# Altium project Steering_Wheel_ECU.PrjPcb
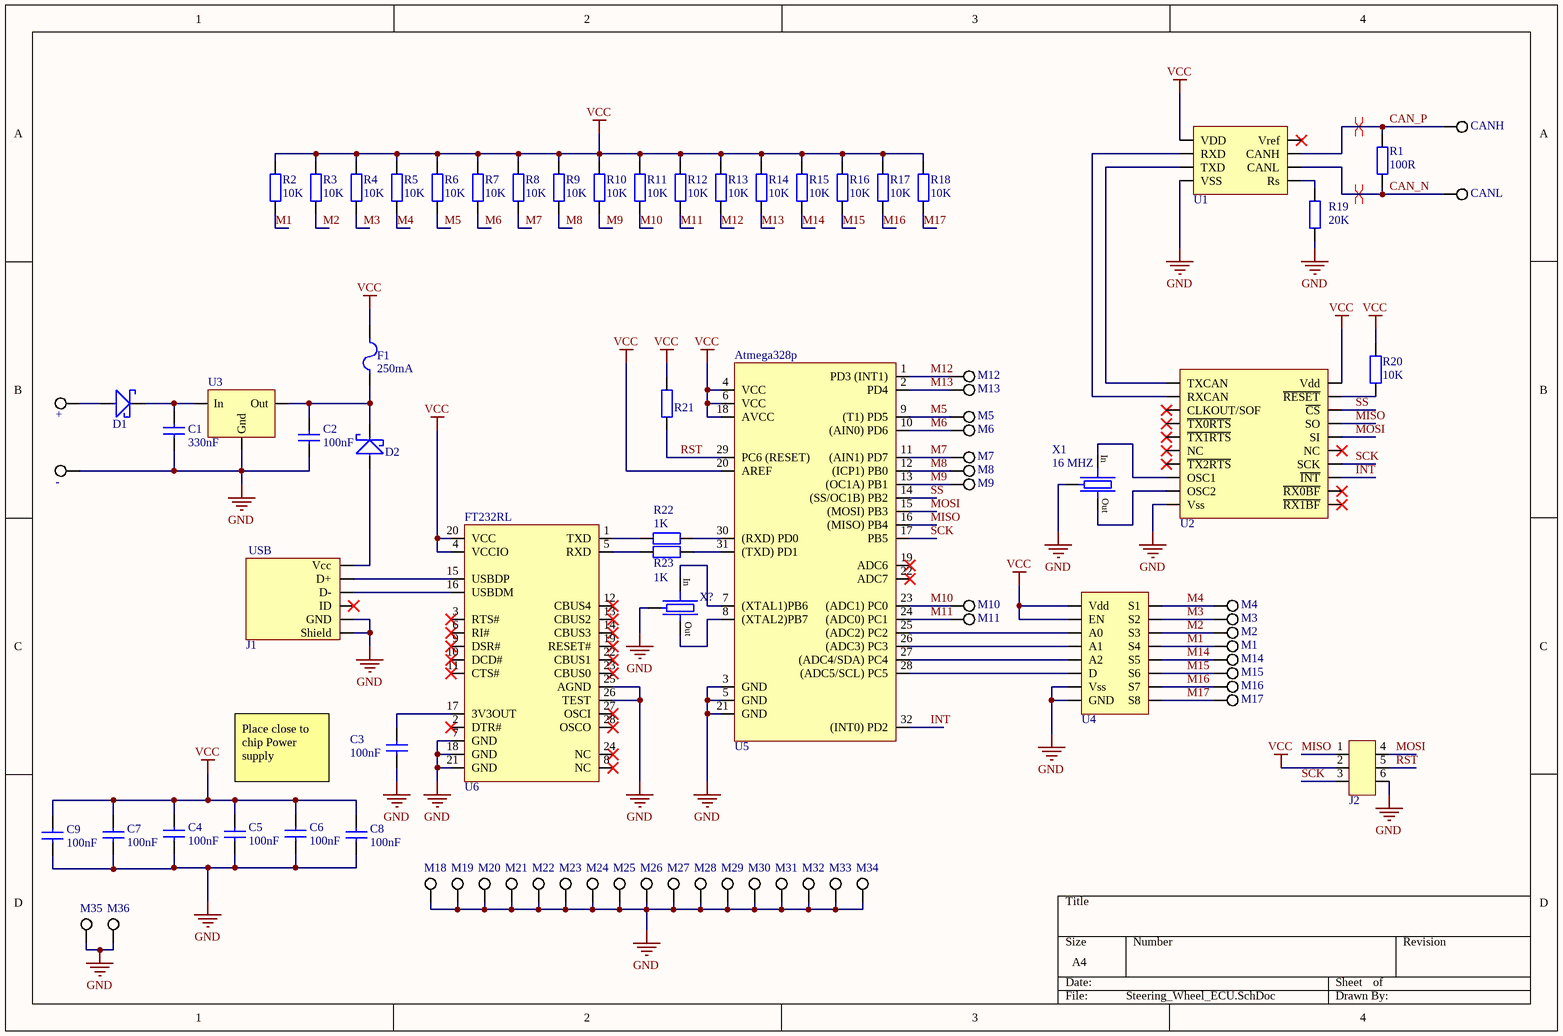
[diagram p0: Steering_Wheel_ECU.SchDoc]
1 sheet, 85 parts. Net scope: global (net labels, ports and power ports of the same name join across sheets).
Board file: Steering_Wheel_ECU.PcbDoc

## Sheet Steering_Wheel_ECU.SchDoc
size A4

### Parts
+  2mm  [HOLE_2MM]  (value not drawn)
-  2mm  [HOLE_2MM]  (value not drawn)
C1  330nF  [CAPC320X160X90L50N]
C2  100nF  [CAPC160X80X87L35N]
C3  100nF  [CAPC160X80X87L35N]
C4  100nF  [CAPC160X80X87L35N]
C5  100nF  [CAPC160X80X87L35N]
C6  100nF  [CAPC160X80X87L35N]
C7  100nF  [CAPC160X80X87L35N]
C8  100nF  [CAPC160X80X87L35N]
C9  100nF  [CAPC160X80X87L35N]
CANH  2mm  [HOLE_2MM]  (value not drawn)
CANL  2mm  [HOLE_2MM]  (value not drawn)
D1  MBR0540  [SOD375X160X128L31X60N]  (value not drawn)
D2  MBR0540  [SOD375X160X128L31X60N]  (value not drawn)
F1  250mA  [FUSC325X165X75L42N]
J1  USB  [USB_mini]
J2  Header_2x3  [HDRV6W64P254_3X2_762X508H1100N]  (value not drawn)
M1  2mm  [HOLE_2MM]  (value not drawn)
M2  2mm  [HOLE_2MM]  (value not drawn)
M3  2mm  [HOLE_2MM]  (value not drawn)
M4  2mm  [HOLE_2MM]  (value not drawn)
M5  2mm  [HOLE_2MM]  (value not drawn)
M6  2mm  [HOLE_2MM]  (value not drawn)
M7  2mm  [HOLE_2MM]  (value not drawn)
M8  2mm  [HOLE_2MM]  (value not drawn)
M9  2mm  [HOLE_2MM]  (value not drawn)
M10  2mm  [HOLE_2MM]  (value not drawn)
M11  2mm  [HOLE_2MM]  (value not drawn)
M12  2mm  [HOLE_2MM]  (value not drawn)
M13  2mm  [HOLE_2MM]  (value not drawn)
M14  2mm  [HOLE_2MM]  (value not drawn)
M15  2mm  [HOLE_2MM]  (value not drawn)
M16  2mm  [HOLE_2MM]  (value not drawn)
M17  2mm  [HOLE_2MM]  (value not drawn)
M18  2mm  [HOLE_2MM]  (value not drawn)
M19  2mm  [HOLE_2MM]  (value not drawn)
M20  2mm  [HOLE_2MM]  (value not drawn)
M21  2mm  [HOLE_2MM]  (value not drawn)
M22  2mm  [HOLE_2MM]  (value not drawn)
M23  2mm  [HOLE_2MM]  (value not drawn)
M24  2mm  [HOLE_2MM]  (value not drawn)
M25  2mm  [HOLE_2MM]  (value not drawn)
M26  2mm  [HOLE_2MM]  (value not drawn)
M27  2mm  [HOLE_2MM]  (value not drawn)
M28  2mm  [HOLE_2MM]  (value not drawn)
M29  2mm  [HOLE_2MM]  (value not drawn)
M30  2mm  [HOLE_2MM]  (value not drawn)
M31  2mm  [HOLE_2MM]  (value not drawn)
M32  2mm  [HOLE_2MM]  (value not drawn)
M33  2mm  [HOLE_2MM]  (value not drawn)
M34  2mm  [HOLE_2MM]  (value not drawn)
M35  3mm  [MTGNPH300Z400]  (value not drawn)
M36  3mm  [MTGNPH300Z400]  (value not drawn)
R1  100R  [RESC160X80X50L30N]
R2  10K  [RESC160X80X50L30N]
R3  10K  [RESC160X80X50L30N]
R4  10K  [RESC160X80X50L30N]
R5  10K  [RESC160X80X50L30N]
R6  10K  [RESC160X80X50L30N]
R7  10K  [RESC160X80X50L30N]
R8  10K  [RESC160X80X50L30N]
R9  10K  [RESC160X80X50L30N]
R10  10K  [RESC160X80X50L30N]
R11  10K  [RESC160X80X50L30N]
R12  10K  [RESC160X80X50L30N]
R13  10K  [RESC160X80X50L30N]
R14  10K  [RESC160X80X50L30N]
R15  10K  [RESC160X80X50L30N]
R16  10K  [RESC160X80X50L30N]
R17  10K  [RESC160X80X50L30N]
R18  10K  [RESC160X80X50L30N]
R19  20K  [RESC160X80X50L30N]
R20  10K  [RESC160X80X50L30N]
R21  10K  [RESC160X80X50L30N]  (value not drawn)
R22  1K  [RESC160X80X50L30N]
R23  1K  [RESC160X80X50L30N]
U1  MCP2551  [SOIC8P127_490X600X175L83X24N]  (value not drawn)
U2  MCP2515T  [SOP20P65_650X640X120L60X24N]  (value not drawn)
U3  5V  [SOT223-4P230_700X180L80X75N]  (value not drawn)
U4  ADG708BRUZ  [SOP16P65_500X640X120L60X24N]  (value not drawn)
U5  Atmega328p  [QFP32P80_900X900X120L60X37N]
U6  FT232RL  [CFP28P65_1020X780X200L75X30N]
X1  16 MHZ  [OSCSC6P120_320X130X100L130X40N]
X?  16 MHZ  [OSCSC6P120_320X130X100L130X40N]  (value not drawn)

### Nets
GND: -.1 C1.2 C2.2 C3.2 C4.2 C5.2 C6.2 C7.2 C8.2 C9.2 J1.5(GND) J1.6(Shield) J2.6 M18.1 M19.1 M20.1 M21.1 M22.1 M23.1 M24.1 M25.1 M26.1 M27.1 M28.1 M29.1 M30.1 M31.1 M32.1 M33.1 M34.1 M35.1 M36.1 R19.1 U1.2(VSS) U2.10(Vss) U3.2(Gnd) U4.3(Vss) U4.14(GND) U5.3(GND) U5.5(GND) U5.21(GND) U6.7(GND) U6.18(GND) U6.21(GND) U6.25(AGND) U6.26(TEST) X1.2 X?.2
VCC: C4.1 C5.1 C6.1 C7.1 C8.1 C9.1 F1.1 J2.2 R2.2 R3.2 R4.2 R5.2 R6.2 R7.2 R8.2 R9.2 R10.2 R11.2 R12.2 R13.2 R14.2 R15.2 R16.2 R17.2 R18.2 R20.2 R21.1 U1.3(VDD) U2.20(Vdd) U4.2(EN) U4.13(Vdd) U5.4(VCC) U5.6(VCC) U5.18(AVCC) U5.20(AREF) U6.4(VCCIO) U6.20(VCC)
CAN_N: CANL.1 R1.1 U1.6(CANL)
CAN_P: CANH.1 R1.2 U1.7(CANH)
INT: U2.13(~{INT}) U5.32((INT0)_PD2)
M1: M1.1 R2.1 U4.7(S4)
M2: M2.1 R3.1 U4.6(S3)
M3: M3.1 R4.1 U4.5(S2)
M4: M4.1 R5.1 U4.4(S1)
M5: M5.1 R6.1 U5.9((T1)_PD5)
M6: M6.1 R7.1 U5.10((AIN0)_PD6)
M7: M7.1 R8.1 U5.11((AIN1)_PD7)
M8: M8.1 R9.1 U5.12((ICP1)_PB0)
M9: M9.1 R10.1 U5.13((OC1A)_PB1)
M10: M10.1 R11.1 U5.23((ADC1)_PC0)
M11: M11.1 R12.1 U5.24((ADC0)_PC1)
M12: M12.1 R13.1 U5.1(PD3_(INT1))
M13: M13.1 R14.1 U5.2(PD4)
M14: M14.1 R15.1 U4.12(S5)
M15: M15.1 R16.1 U4.11(S6)
M16: M16.1 R17.1 U4.10(S7)
M17: M17.1 R18.1 U4.9(S8)
MISO: J2.1 U2.17(SO) U5.16((MISO)_PB4)
MOSI: J2.4 U2.16(SI) U5.15((MOSI)_PB3)
RST: J2.5 R21.2 U5.29(PC6_(RESET))
SCK: J2.3 U2.14(SCK) U5.17(PB5)
SS: U2.18(~{CS}) U5.14((SS/OC1B)_PB2)
Net+_1: +.1 D1.A
NetC1_1: C1.1 D1.C U3.1(In)
NetC2_1: C2.1 D2.C F1.2 U3.3(Out)
NetC3_1: C3.1 U6.17(3V3OUT)
NetD2_A: D2.A J1.1(Vcc)
NetJ1_2: J1.2(D-) U6.16(USBDM)
NetJ1_3: J1.3(D+) U6.15(USBDP)
NetR19_2: R19.2 U1.8(Rs)
NetR20_1: R20.1 U2.19(~{RESET})
NetR22_1: R22.1 U6.1(TXD)
NetR22_2: R22.2 U5.30((RXD)_PD0)
NetR23_1: R23.1 U6.5(RXD)
NetR23_2: R23.2 U5.31((TXD)_PD1)
NetU1_1: U1.1(TXD) U2.1(TXCAN)
NetU1_4: U1.4(RXD) U2.2(RXCAN)
NetU2_8: U2.8(OSC2) X1.3
NetU2_9: U2.9(OSC1) X1.1(In)
NetU4_1: U4.1(A0) U5.25((ADC2)_PC2)
NetU4_8: U4.8(D) U5.28((ADC5/SCL)_PC5)
NetU4_15: U4.15(A2) U5.27((ADC4/SDA)_PC4)
NetU4_16: U4.16(A1) U5.26((ADC3)_PC3)
NetU5_7: U5.7((XTAL1)PB6) X?.1(In)
NetU5_8: U5.8((XTAL2)PB7) X?.3

Not connected (* = marked no-connect by the designer): J1 4(ID)*; U1 5(Vref)*; U2 3(CLKOUT/SOF)* 4(~{TX0RTS})* 5(~{TX1RTS})* 6(NC)* 7(~{TX2RTS})* 11(~{RX1BF})* 12(~{RX0BF})* 15(NC)*; U5 19(ADC6)* 22(ADC7)*; U6 2(DTR#)* 3(RTS#)* 6(RI#)* 8(NC)* 9(DSR#)* 10(DCD#)* 11(CTS#)* 12(CBUS4)* 13(CBUS2)* 14(CBUS3)* 19(RESET#)* 22(CBUS1)* 23(CBUS0)* 24(NC)* 27(OSCI)* 28(OSCO)*

### Layout directives
differential pair: CAN_N, CAN_P

### Notes on the sheet
- Place close to chip Power supply
- (in symbol X_16MHZ) Out

### Library data of the parts
+ - CANH CANL M1-M34 = Hole_2mm: FR_SN: M-01; Part Number: Hole_2mm; Value: 2mm
C1 = C_1206_330nF_50V: Manufacturer Part Number: C1206C334M5RACAUTO; Voltage Rating: 50V; Capacitor Case Style: 1206; ComponentLinkDescription: Datasheet; FR_SN: C_NP-03; Part Number: C_1206_330nF_50V; Value: 330nF; ComponentLinkURL: https://hr.mouser.com/datasheet/2/212/KEM_C1023_X7R_AUTO_SMD-1093309.pdf; Supplier Part Number: 80-C1206C334M5RAUTO
C2-C9 = C_0603_100nF_50V: Manufacturer Part Number: C0603T104J5RACTU; Voltage Rating: 50V; Capacitor Case Style: 0603; ComponentLinkDescription: Datasheet; FR_SN: C_NP-02; Part Number: C_0603_100nF_50V; Value: 100nF; ComponentLinkURL: https://hr.mouser.com/datasheet/2/212/KEM_C1027_X7R_COTS_SMD-1099449.pdf; Supplier Part Number: 80-C0603T104J5RACTU
D1 D2 = MBR0540: Max Reverse Voltage: 40 V; Diode Case Style: SOD-123; Forward Current: 500 mA; ComponentLinkDescription: Datasheet; FR_SN: D_S-01; Part Number: MBR0540; Value: MBR0540; Manufacturer Part Number: MBR0540; ComponentLinkURL: https://hr.mouser.com/datasheet/2/308/MBR0540-1306677.pdf; Supplier Part Number: 512-MBR0540
F1 = F_250mA: Manufacturer Part Number: 0ZCJ0025FF2E; Holding Current: 500mA; Fuse Case Style: 1206; ComponentLinkDescription: Datasheet; FR_SN: F-01; Part Number: F_250mA; Value: 250mA; Tripping Current: 250mA; ComponentLinkURL: https://hr.mouser.com/datasheet/2/643/0ZCJ_Nov2016-1132002.pdf; Supplier Part Number: 530-0ZCJ0025FF2E
J1 = USB mini: Manufacturer Part Number: UJ2-MBH-1-SMT-TR; ComponentLinkDescription: Datasheet; FR_SN: C-03; Part Number: USB mini; Value: USB; ComponentLinkURL: https://hr.mouser.com/datasheet/2/670/uj2-mbh-smt-1313286.pdf; Supplier Part Number: 490-UJ2-MBH-1-SMT
J2 = Header_2x3: Manufacturer Part Number: M20-9970345; ComponentLinkDescription: Datasheet; FR_SN: C-02; Part Number: Header_2x3; Value: Header_2x3; ComponentLinkURL: https://hr.mouser.com/datasheet/2/181/M20-997-1133533.pdf; Supplier Part Number: 855-M20-9970345
M35 M36 = Mounting Hole_3mm: FR_SN: M-02; Part Number: Mounting Hole_3mm; Value: 3mm
R1 = R_0603_100R_0W1: Manufacturer Part Number: AC0603FR-13100RL; Power Rating: 0W1; Resistor Case Style: 0603; Temperature Coefficient: 100 PPM / C; FR_SN: R-05; Part Number: R_0603_100R_0W1; Value: 100R; ComponentLink1URL: https://hr.mouser.com/datasheet/2/447/PYu-AC_51_RoHS_L_6-1152827.pdf; ComponentLink1Description: Datasheet; Supplier Part Number: 603-AC0603FR-13100RL
R2-R18 R20 R21 = R_0603_10K_0W1: Manufacturer Part Number: RGT1608P-103-B-T5; Power Rating: 100mW; Resistor Case Style: 0603; Temperature Coefficient: 25 PPM / C; FR_SN: R-02; Part Number: R_0603_10K_0W1; Value: 10K; ComponentLink1URL: https://hr.mouser.com/datasheet/2/392/n_catalog_partition38_en-1388682.pdf; ComponentLink1Description: Datasheet; Supplier Part Number: 754-RGT1608P103BT5
R19 = R_0603_20K_0W1: Manufacturer Part Number: RT0603BRC1020KL; Power Rating: 100mW; Resistor Case Style: 0603; Temperature Coefficient: 15 PPM / C; FR_SN: R-04; Part Number: R_0603_20K_0W1; Value: 20K; ComponentLink1URL: https://hr.mouser.com/datasheet/2/447/PYu-RT_1-to-0.01_RoHS_L_9-1222720.pdf; ComponentLink1Description: Datasheet; Supplier Part Number: 603-RT0603BRC1020KL
R22 R23 = R_0603_1K_0W1: Manufacturer Part Number: CRCW06031K00FKEAC; Power Rating: 0.1W; Resistor Case Style: 0603; Temperature Coefficient: 100 PPM / C; FR_SN: R-01; Part Number: R_0603_1K_0W1; Value: 1K; ComponentLink1URL: https://hr.mouser.com/ProductDetail/Vishay/CRCW06031K00FKEAC?qs=sGAEpiMZZMtlubZbdhIBIIZe04wfiaJW%2fzoax%252b8jFdk%3d; ComponentLink1Description: Datasheet; Supplier Part Number: 71-CRCW06031K00FKEAC
U1 = MCP2551: Manufacturer Part Number: MCP2551-I/SN; IC Case Style: SOIC-8; ComponentLinkDescription: Datasheet; FR_SN: IC_Misc-04; Part Number: MCP2551; Value: MCP2551; Category: Hi Spd CAN Transceiver; ComponentLinkURL: https://hr.mouser.com/datasheet/2/268/20001667G-1115479.pdf; Supplier Part Number: 579-MCP2551-I/SN
U2 = MCP2515: Manufacturer Part Number: MCP2515T-I/ST; IC Case Style: TSSOP-20; ComponentLinkDescription: Datasheet; FR_SN: IC_Misc'03; Part Number: MCP2515; Value: MCP2515T; Category: CAN Controller with SPI Interface; ComponentLinkURL: https://hr.mouser.com/datasheet/2/268/20001801H-708845.pdf; Supplier Part Number: 579-MCP2515T-I/ST
U3 = 7805: Part Number: 7805; Manufacturer Part Number: UA78M05CDCYR; IC Case Style: SOT223 (with common TAB); ComponentLinkDescription: Datasheet; FR_SN: IC_Reg-01; Value: 5V; Category: Positive Voltage Regulators; ComponentLinkURL: http://www.ti.com/lit/ds/symlink/ua78m.pdf; Supplier Part Number: 595-UA78M05CDCYR
U4 = ADG708: Manufacturer Part Number: ADG708BRUZ-REEL7; IC Case Style: TSSOP-16; ComponentLinkDescription: Datasheet; FR_SN: IC_Misc-02; Part Number: ADG708; Value: ADG708BRUZ; Category: Multiplexer Switch 55MHz 3 Ohm CMOS; ComponentLinkURL: https://hr.mouser.com/datasheet/2/609/ADG708_709-878563.pdf; Supplier Part Number: 584-ADG708BRUZ-R7
U5 = Atmega328p: Manufacturer Part Number: ATMEGA328PB-AU; IC Case Style: TQFP-32; ComponentLinkDescription: Datasheet; FR_SN: MCU-01; Part Number: Atmega328p; Value: Atmega328p; Category: Arduino Nano MCU; ComponentLinkURL: https://hr.mouser.com/datasheet/2/268/40001906A-1222909.pdf; Supplier Part Number: 556-ATMEGA328PB-AU
U6 = FT232RL: Manufacturer Part Number: FT232RL-REEL; IC Case Style: SSOP-28; ComponentLinkDescription: Datasheet; FR_SN: IC_Misc-01; Part Number: FT232RL; Value: FT232RL; Category: USB to UART; ComponentLinkURL: https://hr.mouser.com/datasheet/2/163/DS_FT232R-11534.pdf; Supplier Part Number: 895-FT232RL
X1 = X_16MHZ: Manufacturer Part Number: CSTCE16M0V53-R0; Frequency Tolerance: 0.5 %; Frequency: 15 MHZ; Crystal Case Style: CERALOCK; ComponentLinkDescription: Datasheet; FR_SN: X-01; Part Number: X_16MHZ; Value: 16 MHZ; ComponentLinkURL: https://hr.mouser.com/datasheet/2/281/p16e-522700.pdf; Supplier Part Number: 81-CSTCE16M0V53-R0
X? = X_16MHZ: Manufacturer Part Number: CSTNE16M0V53C000R0; Frequency Tolerance: 0.5 %; Frequency: 16Mhz; Crystal Case Style: CERALOCK; ComponentLinkDescription: Datasheet; FR_SN: X-01; Part Number: X_16MHZ; Value: 16 MHZ; ComponentLinkURL: https://hr.mouser.com/datasheet/2/281/p16e-522700.pdf; Supplier Part Number: 81-CSTNE16M0V53C000R